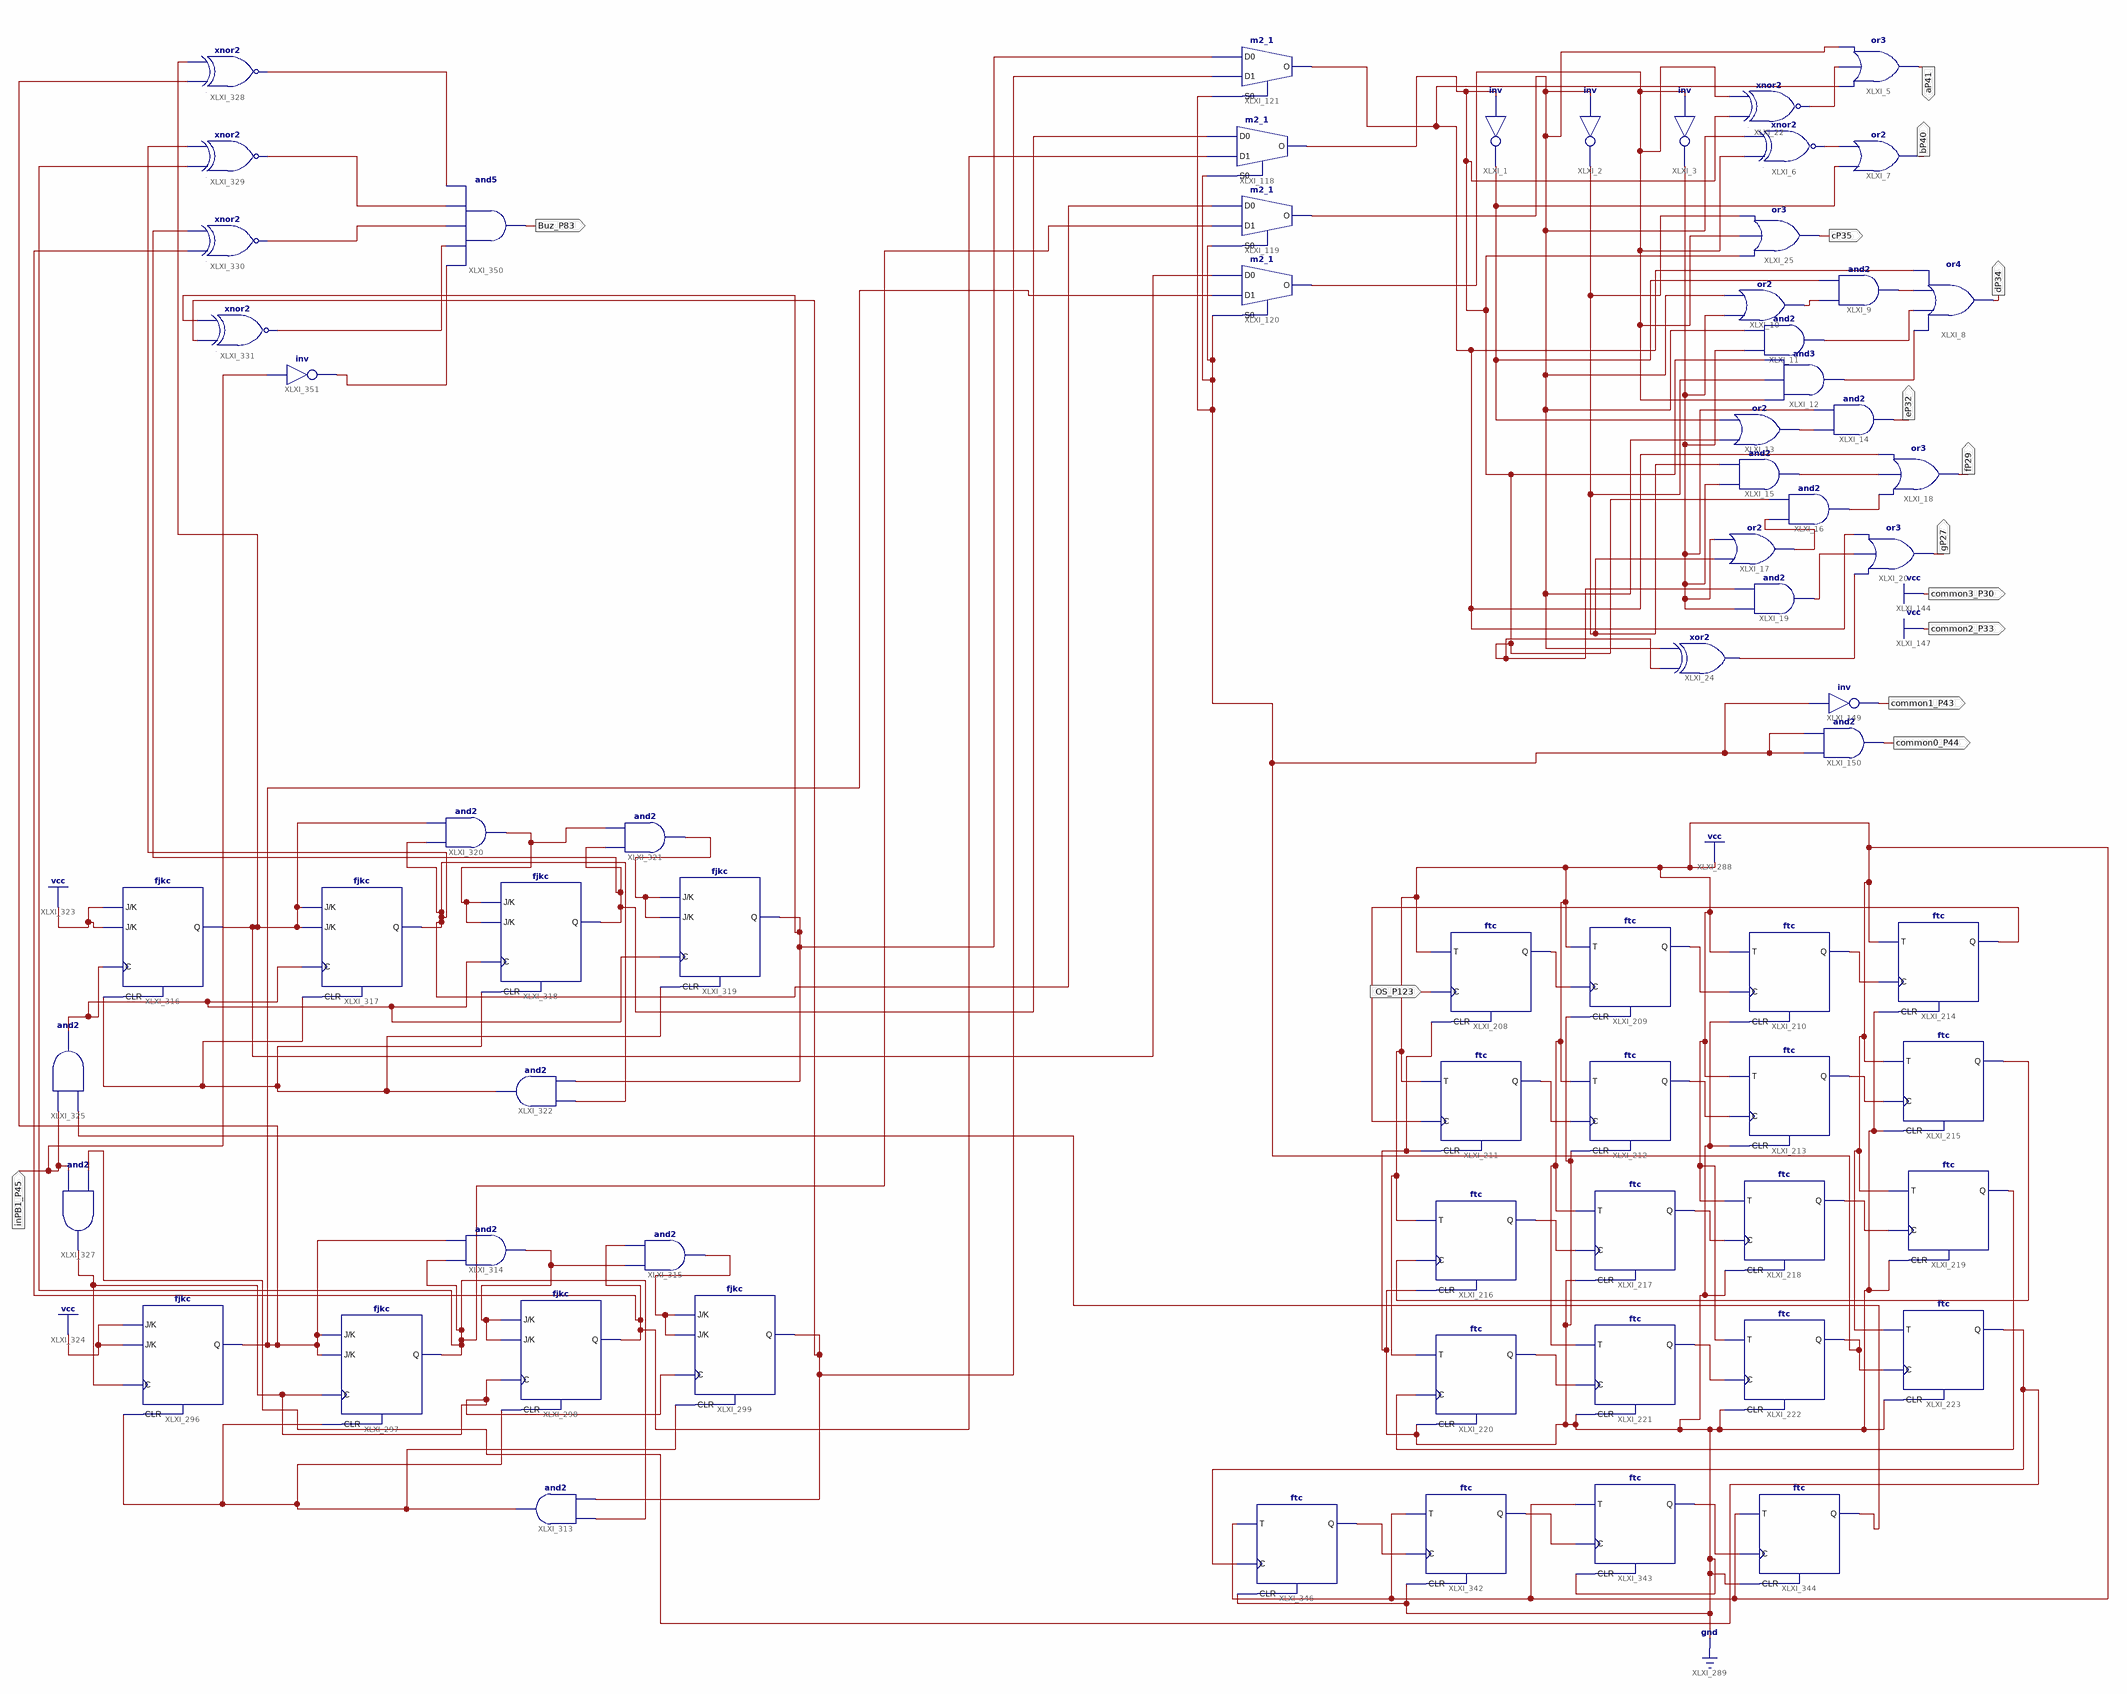
[diagram p0: schematic sheet 1]
// Xilinx ISE schematic lab6.sch (spartan6) as structural Verilog: 70 symbols, 14 ports
module lab6 (
  input  OS_P123,
  input  inPB1_P45,
  output aP41,
  output bP40,
  output cP35,
  output dP34,
  output eP32,
  output fP29,
  output gP27,
  output common3_P30,
  output common2_P33,
  output common1_P43,
  output common0_P44,
  output Buz_P83
);

  wire A_P59, B_P61, C_P62, clk1, D_LSB, D_P66, XLXN_4, XLXN_7, XLXN_9, XLXN_13, XLXN_16, XLXN_17, XLXN_27,
       XLXN_42, XLXN_45, XLXN_46, XLXN_49, XLXN_52, XLXN_55, XLXN_279, XLXN_286, XLXN_476, XLXN_478,
       XLXN_479, XLXN_481, XLXN_484, XLXN_485, XLXN_486, XLXN_487, XLXN_488, XLXN_489, XLXN_530, XLXN_537,
       XLXN_586, XLXN_593, XLXN_601, XLXN_605, XLXN_623, XLXN_636, XLXN_637, XLXN_638, XLXN_639, XLXN_640,
       XLXN_641, XLXN_642, XLXN_643, XLXN_644, XLXN_645, XLXN_648, XLXN_667, XLXN_670, XLXN_671, XLXN_672,
       XLXN_677, XLXN_678, XLXN_679, XLXN_691, XLXN_701, XLXN_702, XLXN_703;

  not XLXI_1 (XLXN_4, B_P61);
  not XLXI_2 (XLXN_279, C_P62);
  not XLXI_3 (XLXN_17, D_P66);
  or XLXI_5 (aP41, A_P59, XLXN_7, C_P62);
  xnor XLXI_6 (XLXN_9, D_P66, C_P62);
  or XLXI_7 (bP40, XLXN_4, XLXN_9);
  or XLXI_8 (dP34, XLXN_13, XLXN_16, XLXN_27, A_P59);
  or XLXI_10 (XLXN_286, XLXN_17, C_P62);
  and XLXI_11 (XLXN_16, XLXN_17, C_P62);
  and XLXI_12 (XLXN_13, D_P66, XLXN_279, B_P61);
  or XLXI_13 (XLXN_42, C_P62, XLXN_4);
  and XLXI_14 (eP32, XLXN_42, XLXN_17);
  and XLXI_15 (XLXN_45, XLXN_17, XLXN_279);
  and XLXI_16 (XLXN_46, XLXN_49, B_P61);
  or XLXI_17 (XLXN_49, XLXN_279, XLXN_17);
  or XLXI_18 (fP29, XLXN_46, XLXN_45, A_P59);
  and XLXI_19 (XLXN_52, XLXN_17, B_P61);
  or XLXI_20 (gP27, XLXN_55, XLXN_52, A_P59);
  xor XLXI_24 (XLXN_55, B_P61, C_P62);
  xnor XLXI_22 (XLXN_7, B_P61, D_P66);
  or XLXI_25 (cP35, B_P61, D_P66, XLXN_279);
  and XLXI_9 (XLXN_27, XLXN_286, XLXN_4);
  not XLXI_149 (common1_P43, XLXN_667);
  and XLXI_150 (common0_P44, XLXN_667, XLXN_667);
  m2_1 XLXI_118 (.D0(XLXN_644), .D1(XLXN_645), .S0(XLXN_667), .O(B_P61));
  m2_1 XLXI_119 (.D0(XLXN_642), .D1(XLXN_643), .S0(XLXN_667), .O(C_P62));
  m2_1 XLXI_120 (.D0(XLXN_640), .D1(XLXN_641), .S0(XLXN_667), .O(D_P66));
  m2_1 XLXI_121 (.D0(D_LSB), .D1(XLXN_648), .S0(XLXN_667), .O(A_P59));
  ftc XLXI_208 (.C(OS_P123), .CLR(1'b0), .T(1'b1), .Q(XLXN_476));
  ftc XLXI_209 (.C(XLXN_476), .CLR(1'b0), .T(1'b1), .Q(XLXN_478));
  ftc XLXI_210 (.C(XLXN_478), .CLR(1'b0), .T(1'b1), .Q(XLXN_479));
  ftc XLXI_211 (.C(XLXN_481), .CLR(1'b0), .T(1'b1), .Q(XLXN_670));
  ftc XLXI_212 (.C(XLXN_670), .CLR(1'b0), .T(1'b1), .Q(XLXN_671));
  ftc XLXI_213 (.C(XLXN_671), .CLR(1'b0), .T(1'b1), .Q(XLXN_703));
  ftc XLXI_214 (.C(XLXN_479), .CLR(1'b0), .T(1'b1), .Q(XLXN_481));
  ftc XLXI_215 (.C(XLXN_703), .CLR(1'b0), .T(1'b1), .Q(XLXN_484));
  ftc XLXI_216 (.C(XLXN_484), .CLR(1'b0), .T(1'b1), .Q(XLXN_485));
  ftc XLXI_217 (.C(XLXN_485), .CLR(1'b0), .T(1'b1), .Q(XLXN_486));
  ftc XLXI_218 (.C(XLXN_486), .CLR(1'b0), .T(1'b1), .Q(XLXN_487));
  ftc XLXI_219 (.C(XLXN_487), .CLR(1'b0), .T(1'b1), .Q(XLXN_488));
  ftc XLXI_220 (.C(XLXN_488), .CLR(1'b0), .T(1'b1), .Q(XLXN_489));
  ftc XLXI_221 (.C(XLXN_489), .CLR(1'b0), .T(1'b1), .Q(XLXN_691));
  ftc XLXI_222 (.C(XLXN_691), .CLR(1'b0), .T(1'b1), .Q(XLXN_667));
  ftc XLXI_223 (.C(XLXN_667), .CLR(1'b0), .T(1'b1), .Q(XLXN_702));
  fjkc XLXI_296 (.C(XLXN_623), .CLR(XLXN_530), .J(1'b1), .K(1'b1), .Q(XLXN_641));
  fjkc XLXI_297 (.C(XLXN_623), .CLR(XLXN_530), .J(XLXN_641), .K(XLXN_641), .Q(XLXN_643));
  fjkc XLXI_298 (.C(XLXN_623), .CLR(XLXN_530), .J(XLXN_537), .K(XLXN_537), .Q(XLXN_645));
  fjkc XLXI_299 (.C(XLXN_623), .CLR(XLXN_530), .J(XLXN_601), .K(XLXN_601), .Q(XLXN_648));
  and XLXI_313 (XLXN_530, XLXN_648, XLXN_643);
  and XLXI_314 (XLXN_537, XLXN_643, XLXN_641);
  and XLXI_315 (XLXN_601, XLXN_537, XLXN_645);
  fjkc XLXI_317 (.C(clk1), .CLR(XLXN_586), .J(XLXN_640), .K(XLXN_640), .Q(XLXN_642));
  fjkc XLXI_318 (.C(clk1), .CLR(XLXN_586), .J(XLXN_593), .K(XLXN_593), .Q(XLXN_644));
  fjkc XLXI_319 (.C(clk1), .CLR(XLXN_586), .J(XLXN_605), .K(XLXN_605), .Q(D_LSB));
  and XLXI_320 (XLXN_593, XLXN_642, XLXN_640);
  and XLXI_321 (XLXN_605, XLXN_644, XLXN_593);
  and XLXI_322 (XLXN_586, D_LSB, XLXN_642);
  and XLXI_325 (clk1, XLXN_672, inPB1_P45);
  and XLXI_327 (XLXN_623, inPB1_P45, XLXN_702);
  xnor XLXI_328 (XLXN_639, XLXN_641, XLXN_640);
  xnor XLXI_329 (XLXN_638, XLXN_643, XLXN_642);
  xnor XLXI_330 (XLXN_637, XLXN_645, XLXN_644);
  xnor XLXI_331 (XLXN_636, XLXN_648, D_LSB);
  fjkc XLXI_316 (.C(clk1), .CLR(XLXN_586), .J(1'b1), .K(1'b1), .Q(XLXN_640));
  ftc XLXI_342 (.C(XLXN_677), .CLR(1'b0), .T(1'b1), .Q(XLXN_678));
  ftc XLXI_343 (.C(XLXN_678), .CLR(1'b0), .T(1'b1), .Q(XLXN_679));
  ftc XLXI_344 (.C(XLXN_679), .CLR(1'b0), .T(1'b1), .Q(XLXN_672));
  ftc XLXI_346 (.C(XLXN_702), .CLR(1'b0), .T(1'b1), .Q(XLXN_677));
  and XLXI_350 (Buz_P83, XLXN_701, XLXN_636, XLXN_637, XLXN_638, XLXN_639);
  not XLXI_351 (XLXN_701, inPB1_P45);

  assign common2_P33 = 1'b1;
  assign common3_P30 = 1'b1;
endmodule
